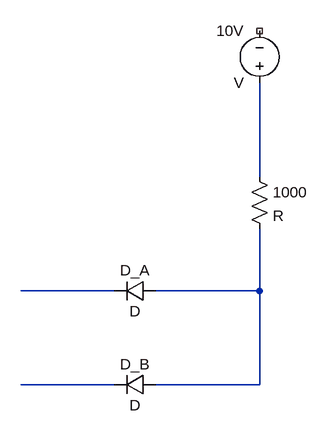
[diagram p0: schematic HW 5 Fig 2.asc]
HW 5 Fig 2.asc, the LTspice schematic file:
Version 4
SHEET 1 880 680
WIRE 240 64 240 -80
WIRE 16 240 -128 240
WIRE 240 240 240 144
WIRE 240 240 80 240
WIRE 16 384 -128 384
WIRE 240 384 240 240
WIRE 240 384 80 384
SYMBOL res 224 48 R0
SYMATTR InstName 1000
SYMBOL diode 80 224 R90
WINDOW 0 0 32 VBottom 2
WINDOW 3 32 32 VTop 2
SYMATTR InstName D_A
SYMBOL diode 80 368 R90
WINDOW 0 0 32 VBottom 2
WINDOW 3 32 32 VTop 2
SYMATTR InstName D_B
SYMBOL voltage 240 -64 R180
WINDOW 0 24 96 Left 2
WINDOW 3 24 16 Left 2
SYMATTR InstName 10V

The netlist it stands for:
* HW 5 Fig 2.asc
R§1000 N001 N003 R
D_A N003 N002 D
D_B N003 N004 D
V§10V N001 NC_01 V
.model D D
.lib standard.dio
.backanno
.end